# EAGLE schematic converter (EAGLE 8.7.0)
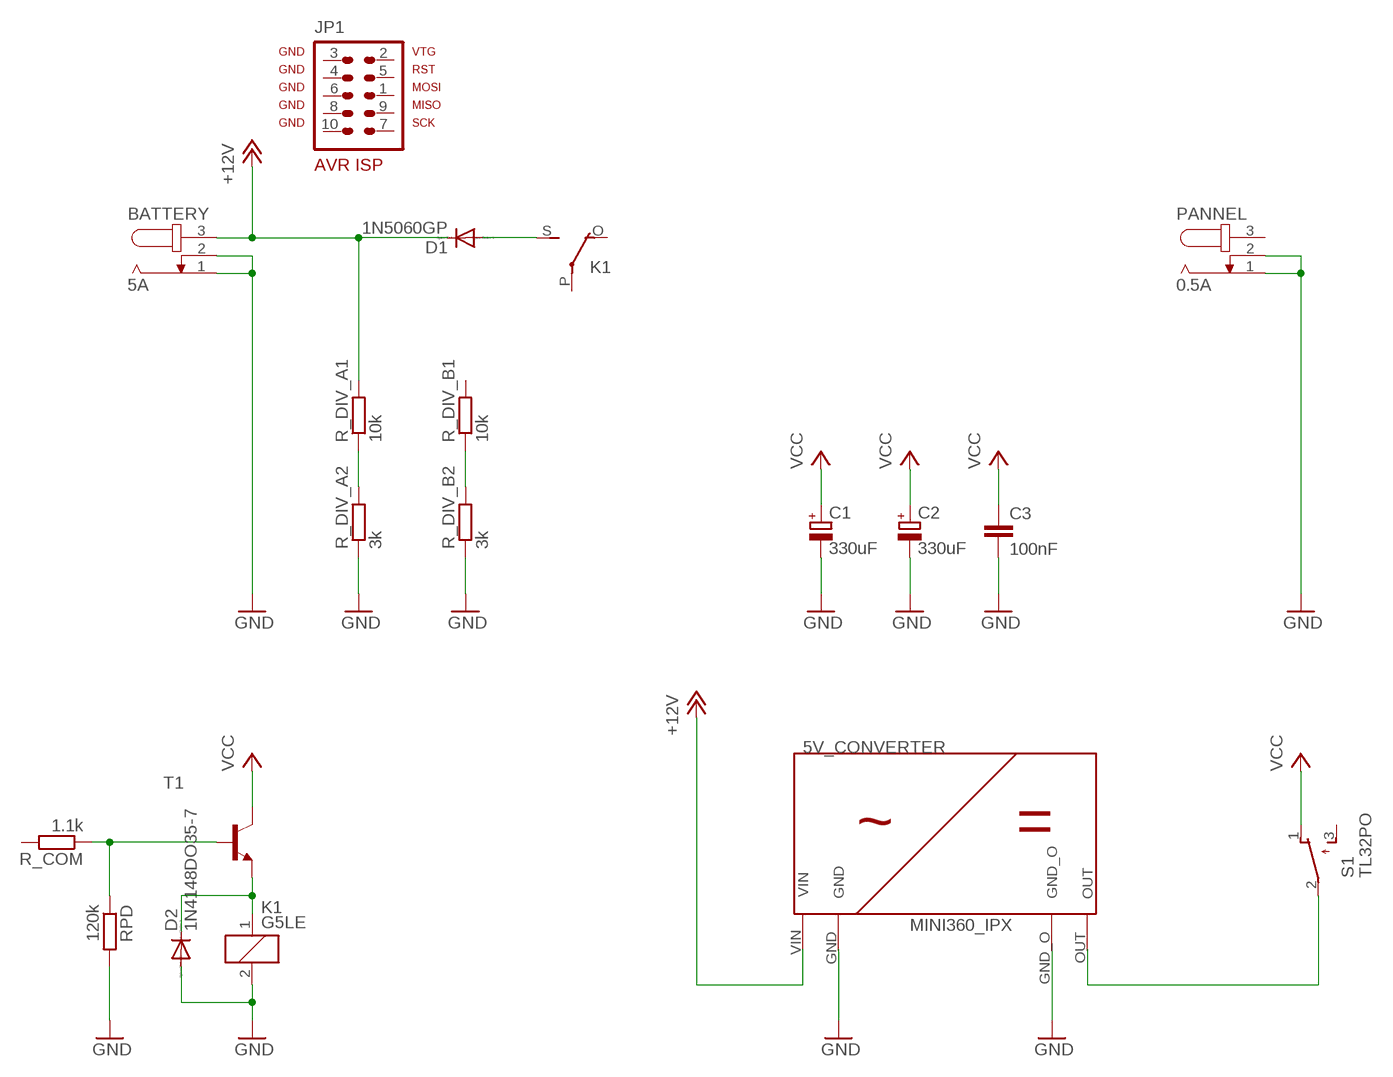
[diagram p0: schematic, sheet 1]

## Parts
5V_CONVERTER  MINI360_IPX  [MINI360_IPX]
BATTERY  5A  JACK-PLUG0  [SPC4077]
C1  330uF  CPOL-EUE2.5-7  [E2,5-7]
C2  330uF  CPOL-EUE2.5-7  [E2,5-7]
C3  100nF  C-EU025-030X050  [C025-030X050]
D1  1N5060GP  [DO15-12]
D2  1N4148DO35-7  [DO35-7]
JP1  AVR-ISP-10  [AVR-ISP-10]
K1  G5LE  [G5LE]
PANNEL  0.5A  JACK-PLUG0  [SPC4077]
R_COM  1.1k  R-EU_0207/10  [0207/10]
R_DIV_A1  10k  R-EU_0207/10  [0207/10]
R_DIV_A2  3k  R-EU_0207/10  [0207/10]
R_DIV_B1  10k  R-EU_0207/10  [0207/10]
R_DIV_B2  3k  R-EU_0207/10  [0207/10]
RPD  120k  R-EU_0207/10  [0207/10]
S1  TL32PO  [TL3XPO]
T1  2N5551-NPN-TO92-EBC  [TO92-EBC]

## Nets
+12V: 5V_CONVERTER.VIN BATTERY.3 D1.C R_DIV_A1.2
GND: BATTERY.1 BATTERY.2 C1.- C2.- C3.2 D2.A K1.2 PANNEL.1 PANNEL.2 R_DIV_A2.1 R_DIV_B2.1 RPD.2
N$1: R_DIV_A1.1 R_DIV_A2.2
N$2: R_DIV_B1.1 R_DIV_B2.2
N$4: D1.A K1.S(2:S)
N$5: R_COM.1 RPD.1 T1.B
N$7: D2.C K1.1 T1.E
N$8: S1.2(P)
VCC: C1.+ C2.+ C3.1 S1.1(O) T1.C
Unconnected: 5V_CONVERTER.GND 5V_CONVERTER.GND_O 5V_CONVERTER.OUT JP1.1 JP1.2 JP1.3 JP1.4 JP1.5 JP1.6 JP1.7 JP1.8 JP1.9 JP1.10 K1.O(2:O) K1.P(2:P) PANNEL.3 R_COM.2 R_DIV_B1.2 S1.3(S)

## Library data of the parts
5V_CONVERTER = ipx:MINI360_IPX
BATTERY PANNEL = con-jack:JACK-PLUG: DC POWER JACK Power Jack, DC, Right Angle, Through Hole, Rated 5A at 16VDC, PC Terminals Distributor: Farnell (www.Farnell.de) Drawing: 84N1161.pdf / 84N1162.pdf Manufacturer: SPC Technology (www.spctechnology.com) Type: SPC4077 / SPC 4078; OC_FARNELL: unknown; OC_NEWARK: unknown
C1 C2 = rcl:CPOL-EU: POLARIZED CAPACITOR, European symbol; SPICEPREFIX: C
C3 = rcl:C-EU: CAPACITOR, European symbol; SPICEPREFIX: C
D1 = diode:1N5060GP: DIODE controlled avalanche rectifier
D2 = diode:1N4148: DIODE high speed (Philips)
JP1 = avr-7:AVR-ISP-10: AVR ISP-10 Serial Programming Header
K1 = relay:G5LE: RELAY 1 x switch, 10 A/120 V AC, 8 A/30 V DC, Omron; OC_FARNELL: unknown; OC_NEWARK: unknown
R_COM R_DIV_A1 R_DIV_A2 R_DIV_B1 R_DIV_B2 RPD = rcl:R-EU_: RESISTOR, European symbol; SPICEPREFIX: R
S1 = switch:TL32PO: TINY SWITCH ON - MOM Source: http://www2.produktinfo.conrad.com/datenblaetter/700000-724999/705152-da-01-de-Subminiaturschalter_TL_36YO.pdf
T1 = transistor-neu-to92:*-NPN-: NPN Transistror